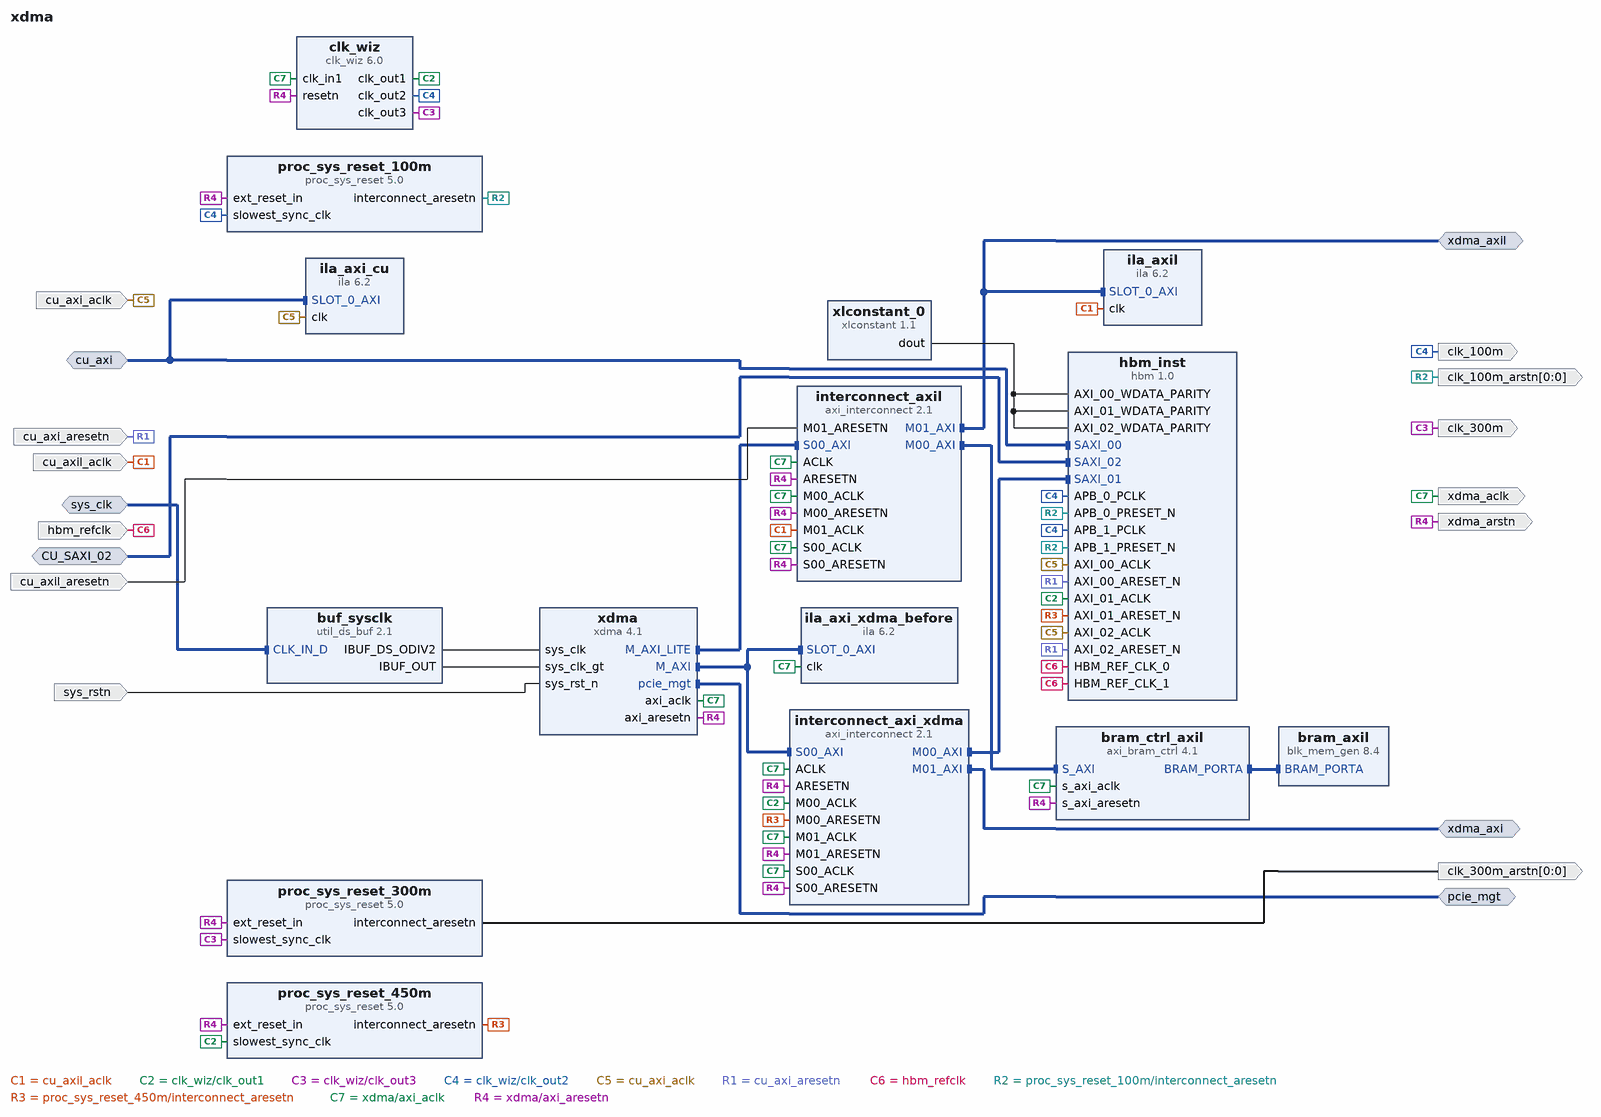
[diagram p0: block diagram of the top level]
# Vivado block design xdma, xcvu37p-fsvh2892-2L-e, Vivado 2020.2.2
create_bd_design xdma

create_bd_intf_port -mode Slave -vlnv xilinx.com:interface:aximm_rtl:1.0 CU_SAXI_02
set_property -dict [list \
  CONFIG.ADDR_WIDTH 36 \
  CONFIG.ARUSER_WIDTH 0 \
  CONFIG.AWUSER_WIDTH 0 \
  CONFIG.BUSER_WIDTH 0 \
  CONFIG.DATA_WIDTH 256 \
  CONFIG.FREQ_HZ 250000000 \
  CONFIG.HAS_BRESP 1 \
  CONFIG.HAS_BURST 1 \
  CONFIG.HAS_CACHE 0 \
  CONFIG.HAS_LOCK 0 \
  CONFIG.HAS_PROT 0 \
  CONFIG.HAS_QOS 0 \
  CONFIG.HAS_REGION 0 \
  CONFIG.HAS_RRESP 1 \
  CONFIG.HAS_WSTRB 1 \
  CONFIG.ID_WIDTH 6 \
  CONFIG.MAX_BURST_LENGTH 16 \
  CONFIG.NUM_READ_OUTSTANDING 2 \
  CONFIG.NUM_READ_THREADS 1 \
  CONFIG.NUM_WRITE_OUTSTANDING 2 \
  CONFIG.NUM_WRITE_THREADS 1 \
  CONFIG.PROTOCOL AXI3 \
  CONFIG.READ_WRITE_MODE READ_WRITE \
  CONFIG.RUSER_BITS_PER_BYTE 0 \
  CONFIG.RUSER_WIDTH 0 \
  CONFIG.SUPPORTS_NARROW_BURST 1 \
  CONFIG.WUSER_BITS_PER_BYTE 0 \
  CONFIG.WUSER_WIDTH 0 \
] [get_bd_intf_ports CU_SAXI_02]
create_bd_intf_port -mode Slave -vlnv xilinx.com:interface:aximm_rtl:1.0 cu_axi
set_property -dict [list \
  CONFIG.ADDR_WIDTH 36 \
  CONFIG.ARUSER_WIDTH 0 \
  CONFIG.AWUSER_WIDTH 0 \
  CONFIG.BUSER_WIDTH 0 \
  CONFIG.DATA_WIDTH 256 \
  CONFIG.FREQ_HZ 250000000 \
  CONFIG.HAS_BRESP 1 \
  CONFIG.HAS_BURST 1 \
  CONFIG.HAS_CACHE 0 \
  CONFIG.HAS_LOCK 0 \
  CONFIG.HAS_PROT 0 \
  CONFIG.HAS_QOS 0 \
  CONFIG.HAS_REGION 0 \
  CONFIG.HAS_RRESP 1 \
  CONFIG.HAS_WSTRB 1 \
  CONFIG.ID_WIDTH 6 \
  CONFIG.MAX_BURST_LENGTH 16 \
  CONFIG.NUM_READ_OUTSTANDING 2 \
  CONFIG.NUM_READ_THREADS 1 \
  CONFIG.NUM_WRITE_OUTSTANDING 2 \
  CONFIG.NUM_WRITE_THREADS 1 \
  CONFIG.PROTOCOL AXI3 \
  CONFIG.READ_WRITE_MODE READ_WRITE \
  CONFIG.RUSER_BITS_PER_BYTE 0 \
  CONFIG.RUSER_WIDTH 0 \
  CONFIG.SUPPORTS_NARROW_BURST 1 \
  CONFIG.WUSER_BITS_PER_BYTE 0 \
  CONFIG.WUSER_WIDTH 0 \
] [get_bd_intf_ports cu_axi]
create_bd_intf_port -mode Master -vlnv xilinx.com:interface:pcie_7x_mgt_rtl:1.0 pcie_mgt
create_bd_intf_port -mode Slave -vlnv xilinx.com:interface:diff_clock_rtl:1.0 sys_clk
set_property -dict {CONFIG.FREQ_HZ 100000000} [get_bd_intf_ports sys_clk]
create_bd_intf_port -mode Master -vlnv xilinx.com:interface:aximm_rtl:1.0 xdma_axi
set_property -dict [list \
  CONFIG.ADDR_WIDTH 34 \
  CONFIG.DATA_WIDTH 512 \
  CONFIG.FREQ_HZ 250000000 \
  CONFIG.NUM_READ_OUTSTANDING 2 \
  CONFIG.NUM_WRITE_OUTSTANDING 2 \
  CONFIG.PROTOCOL AXI4 \
] [get_bd_intf_ports xdma_axi]
create_bd_intf_port -mode Master -vlnv xilinx.com:interface:aximm_rtl:1.0 xdma_axil
set_property -dict [list \
  CONFIG.ADDR_WIDTH 32 \
  CONFIG.DATA_WIDTH 32 \
  CONFIG.NUM_READ_OUTSTANDING 2 \
  CONFIG.NUM_WRITE_OUTSTANDING 2 \
  CONFIG.PROTOCOL AXI4 \
] [get_bd_intf_ports xdma_axil]
create_bd_port -dir O -type clk clk_100m
set_property -dict {CONFIG.ASSOCIATED_RESET clk_100m_arstn} [get_bd_ports clk_100m]
create_bd_port -dir O -from 0 -to 0 -type rst clk_100m_arstn
create_bd_port -dir O -type clk clk_300m
set_property -dict {CONFIG.ASSOCIATED_RESET clk_300m_arstn CONFIG.FREQ_HZ 300000000} [get_bd_ports clk_300m]
create_bd_port -dir O -from 0 -to 0 -type rst clk_300m_arstn
create_bd_port -dir I -type clk cu_axi_aclk
set_property -dict [list \
  CONFIG.ASSOCIATED_BUSIF cu_axi:CU_SAXI_02 \
  CONFIG.ASSOCIATED_RESET cu_axi_aresetn \
  CONFIG.FREQ_HZ 250000000 \
] [get_bd_ports cu_axi_aclk]
create_bd_port -dir I -type rst cu_axi_aresetn
create_bd_port -dir I -type clk cu_axil_aclk
create_bd_port -dir I -type rst cu_axil_aresetn
create_bd_port -dir I -type clk hbm_refclk
create_bd_port -dir I -type rst sys_rstn
set_property -dict {CONFIG.POLARITY ACTIVE_LOW} [get_bd_ports sys_rstn]
create_bd_port -dir O -type clk xdma_aclk
set_property -dict [list \
  CONFIG.ASSOCIATED_BUSIF xdma_axi \
  CONFIG.ASSOCIATED_RESET xdma_arstn \
  CONFIG.FREQ_HZ 250000000 \
] [get_bd_ports xdma_aclk]
create_bd_port -dir O -type rst xdma_arstn

create_bd_cell -type ip -vlnv xilinx.com:ip:blk_mem_gen:8.4 bram_axil
set_property -dict {CONFIG.EN_SAFETY_CKT false} [get_bd_cells bram_axil]
create_bd_cell -type ip -vlnv xilinx.com:ip:axi_bram_ctrl:4.1 bram_ctrl_axil
set_property -dict {CONFIG.PROTOCOL AXI4LITE CONFIG.SINGLE_PORT_BRAM 1} [get_bd_cells bram_ctrl_axil]
create_bd_cell -type ip -vlnv xilinx.com:ip:util_ds_buf:2.1 buf_sysclk
set_property -dict {CONFIG.C_BUF_TYPE IBUFDSGTE} [get_bd_cells buf_sysclk]
create_bd_cell -type ip -vlnv xilinx.com:ip:clk_wiz:6.0 clk_wiz
set_property -dict [list \
  CONFIG.CLKIN1_JITTER_PS 40.0 \
  CONFIG.CLKOUT1_JITTER 126.973 \
  CONFIG.CLKOUT1_PHASE_ERROR 161.613 \
  CONFIG.CLKOUT1_REQUESTED_OUT_FREQ 450.000 \
  CONFIG.CLKOUT2_JITTER 167.067 \
  CONFIG.CLKOUT2_PHASE_ERROR 161.613 \
  CONFIG.CLKOUT2_REQUESTED_OUT_FREQ 100.000 \
  CONFIG.CLKOUT2_USED true \
  CONFIG.CLKOUT3_JITTER 136.449 \
  CONFIG.CLKOUT3_PHASE_ERROR 161.613 \
  CONFIG.CLKOUT3_REQUESTED_OUT_FREQ 300.000 \
  CONFIG.CLKOUT3_USED true \
  CONFIG.MMCM_CLKFBOUT_MULT_F 18.000 \
  CONFIG.MMCM_CLKIN1_PERIOD 4.000 \
  CONFIG.MMCM_CLKIN2_PERIOD 10.0 \
  CONFIG.MMCM_CLKOUT0_DIVIDE_F 2.000 \
  CONFIG.MMCM_CLKOUT1_DIVIDE 9 \
  CONFIG.MMCM_CLKOUT2_DIVIDE 3 \
  CONFIG.MMCM_DIVCLK_DIVIDE 5 \
  CONFIG.NUM_OUT_CLKS 3 \
  CONFIG.RESET_PORT resetn \
  CONFIG.RESET_TYPE ACTIVE_LOW \
  CONFIG.USE_LOCKED false \
] [get_bd_cells clk_wiz]
create_bd_cell -type ip -vlnv xilinx.com:ip:hbm:1.0 hbm_inst
set_property -dict [list \
  CONFIG.USER_APB_EN false \
  CONFIG.USER_CLK_SEL_LIST0 AXI_01_ACLK \
  CONFIG.USER_CLK_SEL_LIST1 AXI_16_ACLK \
  CONFIG.USER_DIS_REF_CLK_BUFG FALSE \
  CONFIG.USER_HBM_DENSITY 8GB \
  CONFIG.USER_HBM_STACK 2 \
  CONFIG.USER_INIT_TIMEOUT_VAL 0 \
  CONFIG.USER_MC0_ECC_SCRUB_PERIOD 0x0032 \
  CONFIG.USER_MC0_ENABLE_ECC_CORRECTION true \
  CONFIG.USER_MC0_ENABLE_ECC_SCRUBBING true \
  CONFIG.USER_MC0_TEMP_CTRL_SELF_REF_INTVL true \
  CONFIG.USER_MC10_ECC_SCRUB_PERIOD 0x0032 \
  CONFIG.USER_MC10_ENABLE_ECC_CORRECTION true \
  CONFIG.USER_MC10_ENABLE_ECC_SCRUBBING true \
  CONFIG.USER_MC10_INITILIZE_MEM_USING_ECC_SCRUB true \
  CONFIG.USER_MC10_TEMP_CTRL_SELF_REF_INTVL true \
  CONFIG.USER_MC11_ECC_SCRUB_PERIOD 0x0032 \
  CONFIG.USER_MC11_ENABLE_ECC_CORRECTION true \
  CONFIG.USER_MC11_ENABLE_ECC_SCRUBBING true \
  CONFIG.USER_MC11_INITILIZE_MEM_USING_ECC_SCRUB true \
  CONFIG.USER_MC11_TEMP_CTRL_SELF_REF_INTVL true \
  CONFIG.USER_MC12_ECC_SCRUB_PERIOD 0x0032 \
  CONFIG.USER_MC12_ENABLE_ECC_CORRECTION true \
  CONFIG.USER_MC12_ENABLE_ECC_SCRUBBING true \
  CONFIG.USER_MC12_INITILIZE_MEM_USING_ECC_SCRUB true \
  CONFIG.USER_MC12_TEMP_CTRL_SELF_REF_INTVL true \
  CONFIG.USER_MC13_ECC_SCRUB_PERIOD 0x0032 \
  CONFIG.USER_MC13_ENABLE_ECC_CORRECTION true \
  CONFIG.USER_MC13_ENABLE_ECC_SCRUBBING true \
  CONFIG.USER_MC13_INITILIZE_MEM_USING_ECC_SCRUB true \
  CONFIG.USER_MC13_TEMP_CTRL_SELF_REF_INTVL true \
  CONFIG.USER_MC14_ECC_SCRUB_PERIOD 0x0032 \
  CONFIG.USER_MC14_ENABLE_ECC_CORRECTION true \
  CONFIG.USER_MC14_ENABLE_ECC_SCRUBBING true \
  CONFIG.USER_MC14_INITILIZE_MEM_USING_ECC_SCRUB true \
  CONFIG.USER_MC14_TEMP_CTRL_SELF_REF_INTVL true \
  CONFIG.USER_MC15_ECC_SCRUB_PERIOD 0x0032 \
  CONFIG.USER_MC15_ENABLE_ECC_CORRECTION true \
  CONFIG.USER_MC15_ENABLE_ECC_SCRUBBING true \
  CONFIG.USER_MC15_INITILIZE_MEM_USING_ECC_SCRUB true \
  CONFIG.USER_MC15_TEMP_CTRL_SELF_REF_INTVL true \
  CONFIG.USER_MC1_ECC_SCRUB_PERIOD 0x0032 \
  CONFIG.USER_MC1_ENABLE_ECC_CORRECTION true \
  CONFIG.USER_MC1_ENABLE_ECC_SCRUBBING true \
  CONFIG.USER_MC1_INITILIZE_MEM_USING_ECC_SCRUB true \
  CONFIG.USER_MC1_TEMP_CTRL_SELF_REF_INTVL true \
  CONFIG.USER_MC2_ECC_SCRUB_PERIOD 0x0032 \
  CONFIG.USER_MC2_ENABLE_ECC_CORRECTION true \
  CONFIG.USER_MC2_ENABLE_ECC_SCRUBBING true \
  CONFIG.USER_MC2_INITILIZE_MEM_USING_ECC_SCRUB true \
  CONFIG.USER_MC2_TEMP_CTRL_SELF_REF_INTVL true \
  CONFIG.USER_MC3_ECC_SCRUB_PERIOD 0x0032 \
  CONFIG.USER_MC3_ENABLE_ECC_CORRECTION true \
  CONFIG.USER_MC3_ENABLE_ECC_SCRUBBING true \
  CONFIG.USER_MC3_INITILIZE_MEM_USING_ECC_SCRUB true \
  CONFIG.USER_MC3_TEMP_CTRL_SELF_REF_INTVL true \
  CONFIG.USER_MC4_ECC_SCRUB_PERIOD 0x0032 \
  CONFIG.USER_MC4_ENABLE_ECC_CORRECTION true \
  CONFIG.USER_MC4_ENABLE_ECC_SCRUBBING true \
  CONFIG.USER_MC4_INITILIZE_MEM_USING_ECC_SCRUB true \
  CONFIG.USER_MC4_TEMP_CTRL_SELF_REF_INTVL true \
  CONFIG.USER_MC5_ECC_SCRUB_PERIOD 0x0032 \
  CONFIG.USER_MC5_ENABLE_ECC_CORRECTION true \
  CONFIG.USER_MC5_ENABLE_ECC_SCRUBBING true \
  CONFIG.USER_MC5_INITILIZE_MEM_USING_ECC_SCRUB true \
  CONFIG.USER_MC5_TEMP_CTRL_SELF_REF_INTVL true \
  CONFIG.USER_MC6_ECC_SCRUB_PERIOD 0x0032 \
  CONFIG.USER_MC6_ENABLE_ECC_CORRECTION true \
  CONFIG.USER_MC6_ENABLE_ECC_SCRUBBING true \
  CONFIG.USER_MC6_INITILIZE_MEM_USING_ECC_SCRUB true \
  CONFIG.USER_MC6_TEMP_CTRL_SELF_REF_INTVL true \
  CONFIG.USER_MC7_ECC_SCRUB_PERIOD 0x0032 \
  CONFIG.USER_MC7_ENABLE_ECC_CORRECTION true \
  CONFIG.USER_MC7_ENABLE_ECC_SCRUBBING true \
  CONFIG.USER_MC7_INITILIZE_MEM_USING_ECC_SCRUB true \
  CONFIG.USER_MC7_TEMP_CTRL_SELF_REF_INTVL true \
  CONFIG.USER_MC8_ECC_SCRUB_PERIOD 0x0032 \
  CONFIG.USER_MC8_ENABLE_ECC_CORRECTION true \
  CONFIG.USER_MC8_ENABLE_ECC_SCRUBBING true \
  CONFIG.USER_MC8_INITILIZE_MEM_USING_ECC_SCRUB true \
  CONFIG.USER_MC8_TEMP_CTRL_SELF_REF_INTVL true \
  CONFIG.USER_MC9_ECC_SCRUB_PERIOD 0x0032 \
  CONFIG.USER_MC9_ENABLE_ECC_CORRECTION true \
  CONFIG.USER_MC9_ENABLE_ECC_SCRUBBING true \
  CONFIG.USER_MC9_INITILIZE_MEM_USING_ECC_SCRUB true \
  CONFIG.USER_MC9_TEMP_CTRL_SELF_REF_INTVL true \
  CONFIG.USER_MC_ENABLE_00 TRUE \
  CONFIG.USER_MC_ENABLE_01 TRUE \
  CONFIG.USER_MC_ENABLE_02 TRUE \
  CONFIG.USER_MC_ENABLE_03 TRUE \
  CONFIG.USER_MC_ENABLE_04 TRUE \
  CONFIG.USER_MC_ENABLE_05 TRUE \
  CONFIG.USER_MC_ENABLE_06 TRUE \
  CONFIG.USER_MC_ENABLE_07 TRUE \
  CONFIG.USER_MC_ENABLE_08 TRUE \
  CONFIG.USER_MC_ENABLE_09 TRUE \
  CONFIG.USER_MC_ENABLE_10 TRUE \
  CONFIG.USER_MC_ENABLE_11 TRUE \
  CONFIG.USER_MC_ENABLE_12 TRUE \
  CONFIG.USER_MC_ENABLE_13 TRUE \
  CONFIG.USER_MC_ENABLE_14 TRUE \
  CONFIG.USER_MC_ENABLE_15 TRUE \
  CONFIG.USER_SAXI_00 true \
  CONFIG.USER_SAXI_01 true \
  CONFIG.USER_SAXI_02 true \
  CONFIG.USER_SAXI_03 false \
  CONFIG.USER_SAXI_04 false \
  CONFIG.USER_SAXI_05 false \
  CONFIG.USER_SAXI_06 false \
  CONFIG.USER_SAXI_07 false \
  CONFIG.USER_SAXI_08 false \
  CONFIG.USER_SAXI_09 false \
  CONFIG.USER_SAXI_10 false \
  CONFIG.USER_SAXI_11 false \
  CONFIG.USER_SAXI_12 false \
  CONFIG.USER_SAXI_13 false \
  CONFIG.USER_SAXI_14 false \
  CONFIG.USER_SAXI_15 false \
  CONFIG.USER_SAXI_16 false \
  CONFIG.USER_SAXI_17 false \
  CONFIG.USER_SAXI_18 false \
  CONFIG.USER_SAXI_19 false \
  CONFIG.USER_SAXI_20 false \
  CONFIG.USER_SAXI_21 false \
  CONFIG.USER_SAXI_22 false \
  CONFIG.USER_SAXI_23 false \
  CONFIG.USER_SAXI_24 false \
  CONFIG.USER_SAXI_25 false \
  CONFIG.USER_SAXI_26 false \
  CONFIG.USER_SAXI_27 false \
  CONFIG.USER_SAXI_28 false \
  CONFIG.USER_SAXI_29 false \
  CONFIG.USER_SAXI_30 false \
  CONFIG.USER_SAXI_31 false \
  CONFIG.USER_SWITCH_ENABLE_01 TRUE \
] [get_bd_cells hbm_inst]
create_bd_cell -type ip -vlnv xilinx.com:ip:ila:6.2 ila_axi_cu
create_bd_cell -type ip -vlnv xilinx.com:ip:ila:6.2 ila_axi_xdma_before
create_bd_cell -type ip -vlnv xilinx.com:ip:ila:6.2 ila_axil
create_bd_cell -type ip -vlnv xilinx.com:ip:axi_interconnect:2.1 interconnect_axi_xdma
set_property -dict {CONFIG.NUM_MI 2 CONFIG.S00_HAS_DATA_FIFO 0} [get_bd_cells interconnect_axi_xdma]
create_bd_cell -type ip -vlnv xilinx.com:ip:axi_interconnect:2.1 interconnect_axil
set_property -dict {CONFIG.NUM_MI 2} [get_bd_cells interconnect_axil]
create_bd_cell -type ip -vlnv xilinx.com:ip:proc_sys_reset:5.0 proc_sys_reset_100m
create_bd_cell -type ip -vlnv xilinx.com:ip:proc_sys_reset:5.0 proc_sys_reset_300m
create_bd_cell -type ip -vlnv xilinx.com:ip:proc_sys_reset:5.0 proc_sys_reset_450m
create_bd_cell -type ip -vlnv xilinx.com:ip:xdma:4.1 xdma
set_property -dict [list \
  CONFIG.PF0_DEVICE_ID_mqdma 903F \
  CONFIG.PF0_SRIOV_VF_DEVICE_ID A03F \
  CONFIG.PF2_DEVICE_ID_mqdma 903F \
  CONFIG.PF3_DEVICE_ID_mqdma 903F \
  CONFIG.axi_data_width 512_bit \
  CONFIG.axil_master_64bit_en true \
  CONFIG.axil_master_prefetchable true \
  CONFIG.axilite_master_en true \
  CONFIG.axilite_master_size 256 \
  CONFIG.axist_bypass_en false \
  CONFIG.axisten_freq 250 \
  CONFIG.cfg_mgmt_if false \
  CONFIG.pcie_blk_locn PCIE4C_X1Y0 \
  CONFIG.pf0_device_id 903F \
  CONFIG.pf0_msi_cap_multimsgcap 1_vector \
  CONFIG.pl_link_cap_max_link_speed 8.0_GT/s \
  CONFIG.pl_link_cap_max_link_width X16 \
  CONFIG.plltype QPLL1 \
  CONFIG.vendor_id 1BD4 \
  CONFIG.xdma_pcie_64bit_en true \
  CONFIG.xdma_pcie_prefetchable true \
] [get_bd_cells xdma]
create_bd_cell -type ip -vlnv xilinx.com:ip:xlconstant:1.1 xlconstant_0
set_property -dict {CONFIG.CONST_VAL 0 CONFIG.CONST_WIDTH 32} [get_bd_cells xlconstant_0]

# ---- connections ----

connect_bd_intf_net [get_bd_intf_pins interconnect_axil/S00_AXI] [get_bd_intf_pins xdma/M_AXI_LITE]
connect_bd_intf_net -intf_net SAXI_02_0_1 [get_bd_intf_ports CU_SAXI_02] [get_bd_intf_pins hbm_inst/SAXI_02]
connect_bd_intf_net [get_bd_intf_pins bram_axil/BRAM_PORTA] [get_bd_intf_pins bram_ctrl_axil/BRAM_PORTA]
connect_bd_intf_net [get_bd_intf_ports cu_axi] [get_bd_intf_pins hbm_inst/SAXI_00]
connect_bd_intf_net [get_bd_intf_ports cu_axi] [get_bd_intf_pins ila_axi_cu/SLOT_0_AXI]
connect_bd_intf_net -intf_net interconnect_axi_M01_AXI [get_bd_intf_pins hbm_inst/SAXI_01] [get_bd_intf_pins interconnect_axi_xdma/M00_AXI]
connect_bd_intf_net [get_bd_intf_ports xdma_axi] [get_bd_intf_pins interconnect_axi_xdma/M01_AXI]
connect_bd_intf_net [get_bd_intf_pins bram_ctrl_axil/S_AXI] [get_bd_intf_pins interconnect_axil/M00_AXI]
connect_bd_intf_net [get_bd_intf_ports xdma_axil] [get_bd_intf_pins interconnect_axil/M01_AXI]
connect_bd_intf_net [get_bd_intf_ports xdma_axil] [get_bd_intf_pins ila_axil/SLOT_0_AXI]
connect_bd_intf_net [get_bd_intf_ports sys_clk] [get_bd_intf_pins buf_sysclk/CLK_IN_D]
connect_bd_intf_net [get_bd_intf_pins interconnect_axi_xdma/S00_AXI] [get_bd_intf_pins xdma/M_AXI]
connect_bd_intf_net [get_bd_intf_pins interconnect_axi_xdma/S00_AXI] [get_bd_intf_pins ila_axi_xdma_before/SLOT_0_AXI]
connect_bd_intf_net -intf_net xdma_soc_pcie_mgt [get_bd_intf_ports pcie_mgt] [get_bd_intf_pins xdma/pcie_mgt]
connect_bd_net -net M01_ACLK_0_1 [get_bd_ports cu_axil_aclk] [get_bd_pins ila_axil/clk] [get_bd_pins interconnect_axil/M01_ACLK]
connect_bd_net -net M01_ARESETN_0_1 [get_bd_ports cu_axil_aresetn] [get_bd_pins interconnect_axil/M01_ARESETN]
connect_bd_net [get_bd_pins buf_sysclk/IBUF_DS_ODIV2] [get_bd_pins xdma/sys_clk]
connect_bd_net [get_bd_pins buf_sysclk/IBUF_OUT] [get_bd_pins xdma/sys_clk_gt]
connect_bd_net [get_bd_pins clk_wiz/clk_out1] \
  [get_bd_pins hbm_inst/AXI_01_ACLK] [get_bd_pins interconnect_axi_xdma/M00_ACLK] \
  [get_bd_pins proc_sys_reset_450m/slowest_sync_clk]
connect_bd_net [get_bd_pins clk_wiz/clk_out3] [get_bd_ports clk_300m] [get_bd_pins proc_sys_reset_300m/slowest_sync_clk]
connect_bd_net [get_bd_pins clk_wiz/clk_out2] \
  [get_bd_ports clk_100m] [get_bd_pins hbm_inst/APB_0_PCLK] [get_bd_pins hbm_inst/APB_1_PCLK] \
  [get_bd_pins proc_sys_reset_100m/slowest_sync_clk]
connect_bd_net [get_bd_ports cu_axi_aclk] [get_bd_pins hbm_inst/AXI_00_ACLK] [get_bd_pins hbm_inst/AXI_02_ACLK] [get_bd_pins ila_axi_cu/clk]
connect_bd_net [get_bd_ports cu_axi_aresetn] [get_bd_pins hbm_inst/AXI_00_ARESET_N] [get_bd_pins hbm_inst/AXI_02_ARESET_N]
connect_bd_net [get_bd_ports hbm_refclk] [get_bd_pins hbm_inst/HBM_REF_CLK_0] [get_bd_pins hbm_inst/HBM_REF_CLK_1]
connect_bd_net [get_bd_pins proc_sys_reset_100m/interconnect_aresetn] \
  [get_bd_ports clk_100m_arstn] [get_bd_pins hbm_inst/APB_0_PRESET_N] [get_bd_pins hbm_inst/APB_1_PRESET_N]
connect_bd_net [get_bd_pins proc_sys_reset_300m/interconnect_aresetn] [get_bd_ports clk_300m_arstn]
connect_bd_net [get_bd_pins proc_sys_reset_450m/interconnect_aresetn] \
  [get_bd_pins hbm_inst/AXI_01_ARESET_N] [get_bd_pins interconnect_axi_xdma/M00_ARESETN]
connect_bd_net [get_bd_ports sys_rstn] [get_bd_pins xdma/sys_rst_n]
connect_bd_net [get_bd_pins xdma/axi_aclk] \
  [get_bd_ports xdma_aclk] [get_bd_pins bram_ctrl_axil/s_axi_aclk] [get_bd_pins clk_wiz/clk_in1] \
  [get_bd_pins ila_axi_xdma_before/clk] [get_bd_pins interconnect_axi_xdma/ACLK] [get_bd_pins interconnect_axi_xdma/M01_ACLK] \
  [get_bd_pins interconnect_axi_xdma/S00_ACLK] [get_bd_pins interconnect_axil/ACLK] [get_bd_pins interconnect_axil/M00_ACLK] \
  [get_bd_pins interconnect_axil/S00_ACLK]
connect_bd_net [get_bd_pins xdma/axi_aresetn] \
  [get_bd_ports xdma_arstn] [get_bd_pins bram_ctrl_axil/s_axi_aresetn] [get_bd_pins clk_wiz/resetn] \
  [get_bd_pins interconnect_axi_xdma/ARESETN] [get_bd_pins interconnect_axi_xdma/M01_ARESETN] \
  [get_bd_pins interconnect_axi_xdma/S00_ARESETN] [get_bd_pins interconnect_axil/ARESETN] \
  [get_bd_pins interconnect_axil/M00_ARESETN] [get_bd_pins interconnect_axil/S00_ARESETN] \
  [get_bd_pins proc_sys_reset_100m/ext_reset_in] [get_bd_pins proc_sys_reset_300m/ext_reset_in] \
  [get_bd_pins proc_sys_reset_450m/ext_reset_in]
connect_bd_net [get_bd_pins xlconstant_0/dout] \
  [get_bd_pins hbm_inst/AXI_00_WDATA_PARITY] [get_bd_pins hbm_inst/AXI_01_WDATA_PARITY] \
  [get_bd_pins hbm_inst/AXI_02_WDATA_PARITY]

# ---- address map ----
assign_bd_address -offset 0x000000000 -range 256M -target_address_space [get_bd_addr_spaces cu_axi] [get_bd_addr_segs hbm_inst/SAXI_00/HBM_MEM00]
assign_bd_address -offset 0x010000000 -range 256M -target_address_space [get_bd_addr_spaces cu_axi] [get_bd_addr_segs hbm_inst/SAXI_00/HBM_MEM01]
assign_bd_address -offset 0x020000000 -range 256M -target_address_space [get_bd_addr_spaces cu_axi] [get_bd_addr_segs hbm_inst/SAXI_00/HBM_MEM02]
assign_bd_address -offset 0x030000000 -range 256M -target_address_space [get_bd_addr_spaces cu_axi] [get_bd_addr_segs hbm_inst/SAXI_00/HBM_MEM03]
assign_bd_address -offset 0x040000000 -range 256M -target_address_space [get_bd_addr_spaces cu_axi] [get_bd_addr_segs hbm_inst/SAXI_00/HBM_MEM04]
assign_bd_address -offset 0x050000000 -range 256M -target_address_space [get_bd_addr_spaces cu_axi] [get_bd_addr_segs hbm_inst/SAXI_00/HBM_MEM05]
assign_bd_address -offset 0x060000000 -range 256M -target_address_space [get_bd_addr_spaces cu_axi] [get_bd_addr_segs hbm_inst/SAXI_00/HBM_MEM06]
assign_bd_address -offset 0x070000000 -range 256M -target_address_space [get_bd_addr_spaces cu_axi] [get_bd_addr_segs hbm_inst/SAXI_00/HBM_MEM07]
assign_bd_address -offset 0x080000000 -range 256M -target_address_space [get_bd_addr_spaces cu_axi] [get_bd_addr_segs hbm_inst/SAXI_00/HBM_MEM08]
assign_bd_address -offset 0x090000000 -range 256M -target_address_space [get_bd_addr_spaces cu_axi] [get_bd_addr_segs hbm_inst/SAXI_00/HBM_MEM09]
assign_bd_address -offset 0x0A0000000 -range 256M -target_address_space [get_bd_addr_spaces cu_axi] [get_bd_addr_segs hbm_inst/SAXI_00/HBM_MEM10]
assign_bd_address -offset 0x0B0000000 -range 256M -target_address_space [get_bd_addr_spaces cu_axi] [get_bd_addr_segs hbm_inst/SAXI_00/HBM_MEM11]
assign_bd_address -offset 0x0C0000000 -range 256M -target_address_space [get_bd_addr_spaces cu_axi] [get_bd_addr_segs hbm_inst/SAXI_00/HBM_MEM12]
assign_bd_address -offset 0x0D0000000 -range 256M -target_address_space [get_bd_addr_spaces cu_axi] [get_bd_addr_segs hbm_inst/SAXI_00/HBM_MEM13]
assign_bd_address -offset 0x0E0000000 -range 256M -target_address_space [get_bd_addr_spaces cu_axi] [get_bd_addr_segs hbm_inst/SAXI_00/HBM_MEM14]
assign_bd_address -offset 0x0F0000000 -range 256M -target_address_space [get_bd_addr_spaces cu_axi] [get_bd_addr_segs hbm_inst/SAXI_00/HBM_MEM15]
assign_bd_address -offset 0x100000000 -range 256M -target_address_space [get_bd_addr_spaces cu_axi] [get_bd_addr_segs hbm_inst/SAXI_00/HBM_MEM16]
assign_bd_address -offset 0x110000000 -range 256M -target_address_space [get_bd_addr_spaces cu_axi] [get_bd_addr_segs hbm_inst/SAXI_00/HBM_MEM17]
assign_bd_address -offset 0x120000000 -range 256M -target_address_space [get_bd_addr_spaces cu_axi] [get_bd_addr_segs hbm_inst/SAXI_00/HBM_MEM18]
assign_bd_address -offset 0x130000000 -range 256M -target_address_space [get_bd_addr_spaces cu_axi] [get_bd_addr_segs hbm_inst/SAXI_00/HBM_MEM19]
assign_bd_address -offset 0x140000000 -range 256M -target_address_space [get_bd_addr_spaces cu_axi] [get_bd_addr_segs hbm_inst/SAXI_00/HBM_MEM20]
assign_bd_address -offset 0x150000000 -range 256M -target_address_space [get_bd_addr_spaces cu_axi] [get_bd_addr_segs hbm_inst/SAXI_00/HBM_MEM21]
assign_bd_address -offset 0x160000000 -range 256M -target_address_space [get_bd_addr_spaces cu_axi] [get_bd_addr_segs hbm_inst/SAXI_00/HBM_MEM22]
assign_bd_address -offset 0x170000000 -range 256M -target_address_space [get_bd_addr_spaces cu_axi] [get_bd_addr_segs hbm_inst/SAXI_00/HBM_MEM23]
assign_bd_address -offset 0x180000000 -range 256M -target_address_space [get_bd_addr_spaces cu_axi] [get_bd_addr_segs hbm_inst/SAXI_00/HBM_MEM24]
assign_bd_address -offset 0x190000000 -range 256M -target_address_space [get_bd_addr_spaces cu_axi] [get_bd_addr_segs hbm_inst/SAXI_00/HBM_MEM25]
assign_bd_address -offset 0x1A0000000 -range 256M -target_address_space [get_bd_addr_spaces cu_axi] [get_bd_addr_segs hbm_inst/SAXI_00/HBM_MEM26]
assign_bd_address -offset 0x1B0000000 -range 256M -target_address_space [get_bd_addr_spaces cu_axi] [get_bd_addr_segs hbm_inst/SAXI_00/HBM_MEM27]
assign_bd_address -offset 0x1C0000000 -range 256M -target_address_space [get_bd_addr_spaces cu_axi] [get_bd_addr_segs hbm_inst/SAXI_00/HBM_MEM28]
assign_bd_address -offset 0x1D0000000 -range 256M -target_address_space [get_bd_addr_spaces cu_axi] [get_bd_addr_segs hbm_inst/SAXI_00/HBM_MEM29]
assign_bd_address -offset 0x1E0000000 -range 256M -target_address_space [get_bd_addr_spaces cu_axi] [get_bd_addr_segs hbm_inst/SAXI_00/HBM_MEM30]
assign_bd_address -offset 0x1F0000000 -range 256M -target_address_space [get_bd_addr_spaces cu_axi] [get_bd_addr_segs hbm_inst/SAXI_00/HBM_MEM31]
assign_bd_address -offset 0x000000000 -range 256M -target_address_space [get_bd_addr_spaces CU_SAXI_02] [get_bd_addr_segs hbm_inst/SAXI_02/HBM_MEM00]
assign_bd_address -offset 0x010000000 -range 256M -target_address_space [get_bd_addr_spaces CU_SAXI_02] [get_bd_addr_segs hbm_inst/SAXI_02/HBM_MEM01]
assign_bd_address -offset 0x020000000 -range 256M -target_address_space [get_bd_addr_spaces CU_SAXI_02] [get_bd_addr_segs hbm_inst/SAXI_02/HBM_MEM02]
assign_bd_address -offset 0x030000000 -range 256M -target_address_space [get_bd_addr_spaces CU_SAXI_02] [get_bd_addr_segs hbm_inst/SAXI_02/HBM_MEM03]
assign_bd_address -offset 0x040000000 -range 256M -target_address_space [get_bd_addr_spaces CU_SAXI_02] [get_bd_addr_segs hbm_inst/SAXI_02/HBM_MEM04]
assign_bd_address -offset 0x050000000 -range 256M -target_address_space [get_bd_addr_spaces CU_SAXI_02] [get_bd_addr_segs hbm_inst/SAXI_02/HBM_MEM05]
assign_bd_address -offset 0x060000000 -range 256M -target_address_space [get_bd_addr_spaces CU_SAXI_02] [get_bd_addr_segs hbm_inst/SAXI_02/HBM_MEM06]
assign_bd_address -offset 0x070000000 -range 256M -target_address_space [get_bd_addr_spaces CU_SAXI_02] [get_bd_addr_segs hbm_inst/SAXI_02/HBM_MEM07]
assign_bd_address -offset 0x080000000 -range 256M -target_address_space [get_bd_addr_spaces CU_SAXI_02] [get_bd_addr_segs hbm_inst/SAXI_02/HBM_MEM08]
assign_bd_address -offset 0x090000000 -range 256M -target_address_space [get_bd_addr_spaces CU_SAXI_02] [get_bd_addr_segs hbm_inst/SAXI_02/HBM_MEM09]
assign_bd_address -offset 0x0A0000000 -range 256M -target_address_space [get_bd_addr_spaces CU_SAXI_02] [get_bd_addr_segs hbm_inst/SAXI_02/HBM_MEM10]
assign_bd_address -offset 0x0B0000000 -range 256M -target_address_space [get_bd_addr_spaces CU_SAXI_02] [get_bd_addr_segs hbm_inst/SAXI_02/HBM_MEM11]
assign_bd_address -offset 0x0C0000000 -range 256M -target_address_space [get_bd_addr_spaces CU_SAXI_02] [get_bd_addr_segs hbm_inst/SAXI_02/HBM_MEM12]
assign_bd_address -offset 0x0D0000000 -range 256M -target_address_space [get_bd_addr_spaces CU_SAXI_02] [get_bd_addr_segs hbm_inst/SAXI_02/HBM_MEM13]
assign_bd_address -offset 0x0E0000000 -range 256M -target_address_space [get_bd_addr_spaces CU_SAXI_02] [get_bd_addr_segs hbm_inst/SAXI_02/HBM_MEM14]
assign_bd_address -offset 0x0F0000000 -range 256M -target_address_space [get_bd_addr_spaces CU_SAXI_02] [get_bd_addr_segs hbm_inst/SAXI_02/HBM_MEM15]
assign_bd_address -offset 0x100000000 -range 256M -target_address_space [get_bd_addr_spaces CU_SAXI_02] [get_bd_addr_segs hbm_inst/SAXI_02/HBM_MEM16]
assign_bd_address -offset 0x110000000 -range 256M -target_address_space [get_bd_addr_spaces CU_SAXI_02] [get_bd_addr_segs hbm_inst/SAXI_02/HBM_MEM17]
assign_bd_address -offset 0x120000000 -range 256M -target_address_space [get_bd_addr_spaces CU_SAXI_02] [get_bd_addr_segs hbm_inst/SAXI_02/HBM_MEM18]
assign_bd_address -offset 0x130000000 -range 256M -target_address_space [get_bd_addr_spaces CU_SAXI_02] [get_bd_addr_segs hbm_inst/SAXI_02/HBM_MEM19]
assign_bd_address -offset 0x140000000 -range 256M -target_address_space [get_bd_addr_spaces CU_SAXI_02] [get_bd_addr_segs hbm_inst/SAXI_02/HBM_MEM20]
assign_bd_address -offset 0x150000000 -range 256M -target_address_space [get_bd_addr_spaces CU_SAXI_02] [get_bd_addr_segs hbm_inst/SAXI_02/HBM_MEM21]
assign_bd_address -offset 0x160000000 -range 256M -target_address_space [get_bd_addr_spaces CU_SAXI_02] [get_bd_addr_segs hbm_inst/SAXI_02/HBM_MEM22]
assign_bd_address -offset 0x170000000 -range 256M -target_address_space [get_bd_addr_spaces CU_SAXI_02] [get_bd_addr_segs hbm_inst/SAXI_02/HBM_MEM23]
assign_bd_address -offset 0x180000000 -range 256M -target_address_space [get_bd_addr_spaces CU_SAXI_02] [get_bd_addr_segs hbm_inst/SAXI_02/HBM_MEM24]
assign_bd_address -offset 0x190000000 -range 256M -target_address_space [get_bd_addr_spaces CU_SAXI_02] [get_bd_addr_segs hbm_inst/SAXI_02/HBM_MEM25]
assign_bd_address -offset 0x1A0000000 -range 256M -target_address_space [get_bd_addr_spaces CU_SAXI_02] [get_bd_addr_segs hbm_inst/SAXI_02/HBM_MEM26]
assign_bd_address -offset 0x1B0000000 -range 256M -target_address_space [get_bd_addr_spaces CU_SAXI_02] [get_bd_addr_segs hbm_inst/SAXI_02/HBM_MEM27]
assign_bd_address -offset 0x1C0000000 -range 256M -target_address_space [get_bd_addr_spaces CU_SAXI_02] [get_bd_addr_segs hbm_inst/SAXI_02/HBM_MEM28]
assign_bd_address -offset 0x1D0000000 -range 256M -target_address_space [get_bd_addr_spaces CU_SAXI_02] [get_bd_addr_segs hbm_inst/SAXI_02/HBM_MEM29]
assign_bd_address -offset 0x1E0000000 -range 256M -target_address_space [get_bd_addr_spaces CU_SAXI_02] [get_bd_addr_segs hbm_inst/SAXI_02/HBM_MEM30]
assign_bd_address -offset 0x1F0000000 -range 256M -target_address_space [get_bd_addr_spaces CU_SAXI_02] [get_bd_addr_segs hbm_inst/SAXI_02/HBM_MEM31]
assign_bd_address -offset 0x0000000000000000 -range 256M -target_address_space [get_bd_addr_spaces xdma/M_AXI] [get_bd_addr_segs hbm_inst/SAXI_01/HBM_MEM00]
assign_bd_address -offset 0x0000000010000000 -range 256M -target_address_space [get_bd_addr_spaces xdma/M_AXI] [get_bd_addr_segs hbm_inst/SAXI_01/HBM_MEM01]
assign_bd_address -offset 0x0000000020000000 -range 256M -target_address_space [get_bd_addr_spaces xdma/M_AXI] [get_bd_addr_segs hbm_inst/SAXI_01/HBM_MEM02]
assign_bd_address -offset 0x0000000030000000 -range 256M -target_address_space [get_bd_addr_spaces xdma/M_AXI] [get_bd_addr_segs hbm_inst/SAXI_01/HBM_MEM03]
assign_bd_address -offset 0x0000000040000000 -range 256M -target_address_space [get_bd_addr_spaces xdma/M_AXI] [get_bd_addr_segs hbm_inst/SAXI_01/HBM_MEM04]
assign_bd_address -offset 0x0000000050000000 -range 256M -target_address_space [get_bd_addr_spaces xdma/M_AXI] [get_bd_addr_segs hbm_inst/SAXI_01/HBM_MEM05]
assign_bd_address -offset 0x0000000060000000 -range 256M -target_address_space [get_bd_addr_spaces xdma/M_AXI] [get_bd_addr_segs hbm_inst/SAXI_01/HBM_MEM06]
assign_bd_address -offset 0x0000000070000000 -range 256M -target_address_space [get_bd_addr_spaces xdma/M_AXI] [get_bd_addr_segs hbm_inst/SAXI_01/HBM_MEM07]
assign_bd_address -offset 0x0000000080000000 -range 256M -target_address_space [get_bd_addr_spaces xdma/M_AXI] [get_bd_addr_segs hbm_inst/SAXI_01/HBM_MEM08]
assign_bd_address -offset 0x0000000090000000 -range 256M -target_address_space [get_bd_addr_spaces xdma/M_AXI] [get_bd_addr_segs hbm_inst/SAXI_01/HBM_MEM09]
assign_bd_address -offset 0x00000000A0000000 -range 256M -target_address_space [get_bd_addr_spaces xdma/M_AXI] [get_bd_addr_segs hbm_inst/SAXI_01/HBM_MEM10]
assign_bd_address -offset 0x00000000B0000000 -range 256M -target_address_space [get_bd_addr_spaces xdma/M_AXI] [get_bd_addr_segs hbm_inst/SAXI_01/HBM_MEM11]
assign_bd_address -offset 0x00000000C0000000 -range 256M -target_address_space [get_bd_addr_spaces xdma/M_AXI] [get_bd_addr_segs hbm_inst/SAXI_01/HBM_MEM12]
assign_bd_address -offset 0x00000000D0000000 -range 256M -target_address_space [get_bd_addr_spaces xdma/M_AXI] [get_bd_addr_segs hbm_inst/SAXI_01/HBM_MEM13]
assign_bd_address -offset 0x00000000E0000000 -range 256M -target_address_space [get_bd_addr_spaces xdma/M_AXI] [get_bd_addr_segs hbm_inst/SAXI_01/HBM_MEM14]
assign_bd_address -offset 0x00000000F0000000 -range 256M -target_address_space [get_bd_addr_spaces xdma/M_AXI] [get_bd_addr_segs hbm_inst/SAXI_01/HBM_MEM15]
assign_bd_address -offset 0x0000000100000000 -range 256M -target_address_space [get_bd_addr_spaces xdma/M_AXI] [get_bd_addr_segs hbm_inst/SAXI_01/HBM_MEM16]
assign_bd_address -offset 0x0000000110000000 -range 256M -target_address_space [get_bd_addr_spaces xdma/M_AXI] [get_bd_addr_segs hbm_inst/SAXI_01/HBM_MEM17]
assign_bd_address -offset 0x0000000120000000 -range 256M -target_address_space [get_bd_addr_spaces xdma/M_AXI] [get_bd_addr_segs hbm_inst/SAXI_01/HBM_MEM18]
assign_bd_address -offset 0x0000000130000000 -range 256M -target_address_space [get_bd_addr_spaces xdma/M_AXI] [get_bd_addr_segs hbm_inst/SAXI_01/HBM_MEM19]
assign_bd_address -offset 0x0000000140000000 -range 256M -target_address_space [get_bd_addr_spaces xdma/M_AXI] [get_bd_addr_segs hbm_inst/SAXI_01/HBM_MEM20]
assign_bd_address -offset 0x0000000150000000 -range 256M -target_address_space [get_bd_addr_spaces xdma/M_AXI] [get_bd_addr_segs hbm_inst/SAXI_01/HBM_MEM21]
assign_bd_address -offset 0x0000000160000000 -range 256M -target_address_space [get_bd_addr_spaces xdma/M_AXI] [get_bd_addr_segs hbm_inst/SAXI_01/HBM_MEM22]
assign_bd_address -offset 0x0000000170000000 -range 256M -target_address_space [get_bd_addr_spaces xdma/M_AXI] [get_bd_addr_segs hbm_inst/SAXI_01/HBM_MEM23]
assign_bd_address -offset 0x0000000180000000 -range 256M -target_address_space [get_bd_addr_spaces xdma/M_AXI] [get_bd_addr_segs hbm_inst/SAXI_01/HBM_MEM24]
assign_bd_address -offset 0x0000000190000000 -range 256M -target_address_space [get_bd_addr_spaces xdma/M_AXI] [get_bd_addr_segs hbm_inst/SAXI_01/HBM_MEM25]
assign_bd_address -offset 0x00000001A0000000 -range 256M -target_address_space [get_bd_addr_spaces xdma/M_AXI] [get_bd_addr_segs hbm_inst/SAXI_01/HBM_MEM26]
assign_bd_address -offset 0x00000001B0000000 -range 256M -target_address_space [get_bd_addr_spaces xdma/M_AXI] [get_bd_addr_segs hbm_inst/SAXI_01/HBM_MEM27]
assign_bd_address -offset 0x00000001C0000000 -range 256M -target_address_space [get_bd_addr_spaces xdma/M_AXI] [get_bd_addr_segs hbm_inst/SAXI_01/HBM_MEM28]
assign_bd_address -offset 0x00000001D0000000 -range 256M -target_address_space [get_bd_addr_spaces xdma/M_AXI] [get_bd_addr_segs hbm_inst/SAXI_01/HBM_MEM29]
assign_bd_address -offset 0x00000001E0000000 -range 256M -target_address_space [get_bd_addr_spaces xdma/M_AXI] [get_bd_addr_segs hbm_inst/SAXI_01/HBM_MEM30]
assign_bd_address -offset 0x00000001F0000000 -range 256M -target_address_space [get_bd_addr_spaces xdma/M_AXI] [get_bd_addr_segs hbm_inst/SAXI_01/HBM_MEM31]
assign_bd_address -offset 0x0000000200000000 -range 256M -target_address_space [get_bd_addr_spaces xdma/M_AXI] [get_bd_addr_segs xdma_axi/Reg]
assign_bd_address -offset 0x00000000 -range 16M -target_address_space [get_bd_addr_spaces xdma/M_AXI_LITE] [get_bd_addr_segs xdma_axil/Reg]
assign_bd_address -offset 0x01000000 -range 4K -target_address_space [get_bd_addr_spaces xdma/M_AXI_LITE] [get_bd_addr_segs bram_ctrl_axil/S_AXI/Mem0]

validate_bd_design
save_bd_design
